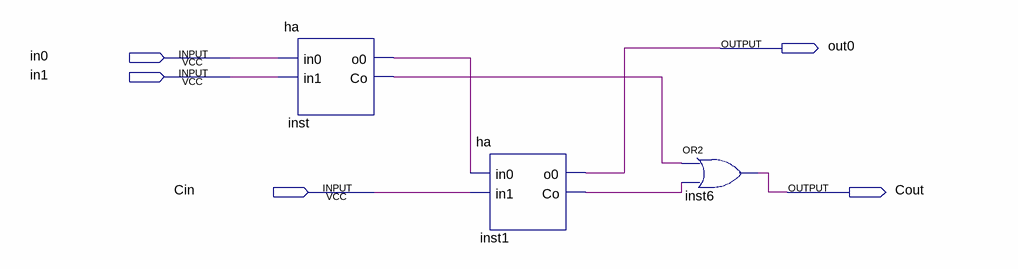
[diagram p0: schematic sheet]
// Quartus schematic fa.bdf as structural Verilog: 3 symbols, 5 pins
module fa (
  input  in0,
  input  in1,
  input  Cin,
  output out0,
  output Cout
);

  wire inst1_co, inst_co, inst_o0;

  ha inst (.in0(in0), .in1(in1), .o0(inst_o0), .Co(inst_co));
  ha inst1 (.in0(inst_o0), .in1(Cin), .o0(out0), .Co(inst1_co));
  or inst6 (Cout, inst_co, inst1_co);
endmodule
